# Altium schematic sheet ZYNQ_MIOBank_500.SchDoc
size A4; DocumentNumber: 8; SheetNumber: 8; SheetTotal: 47
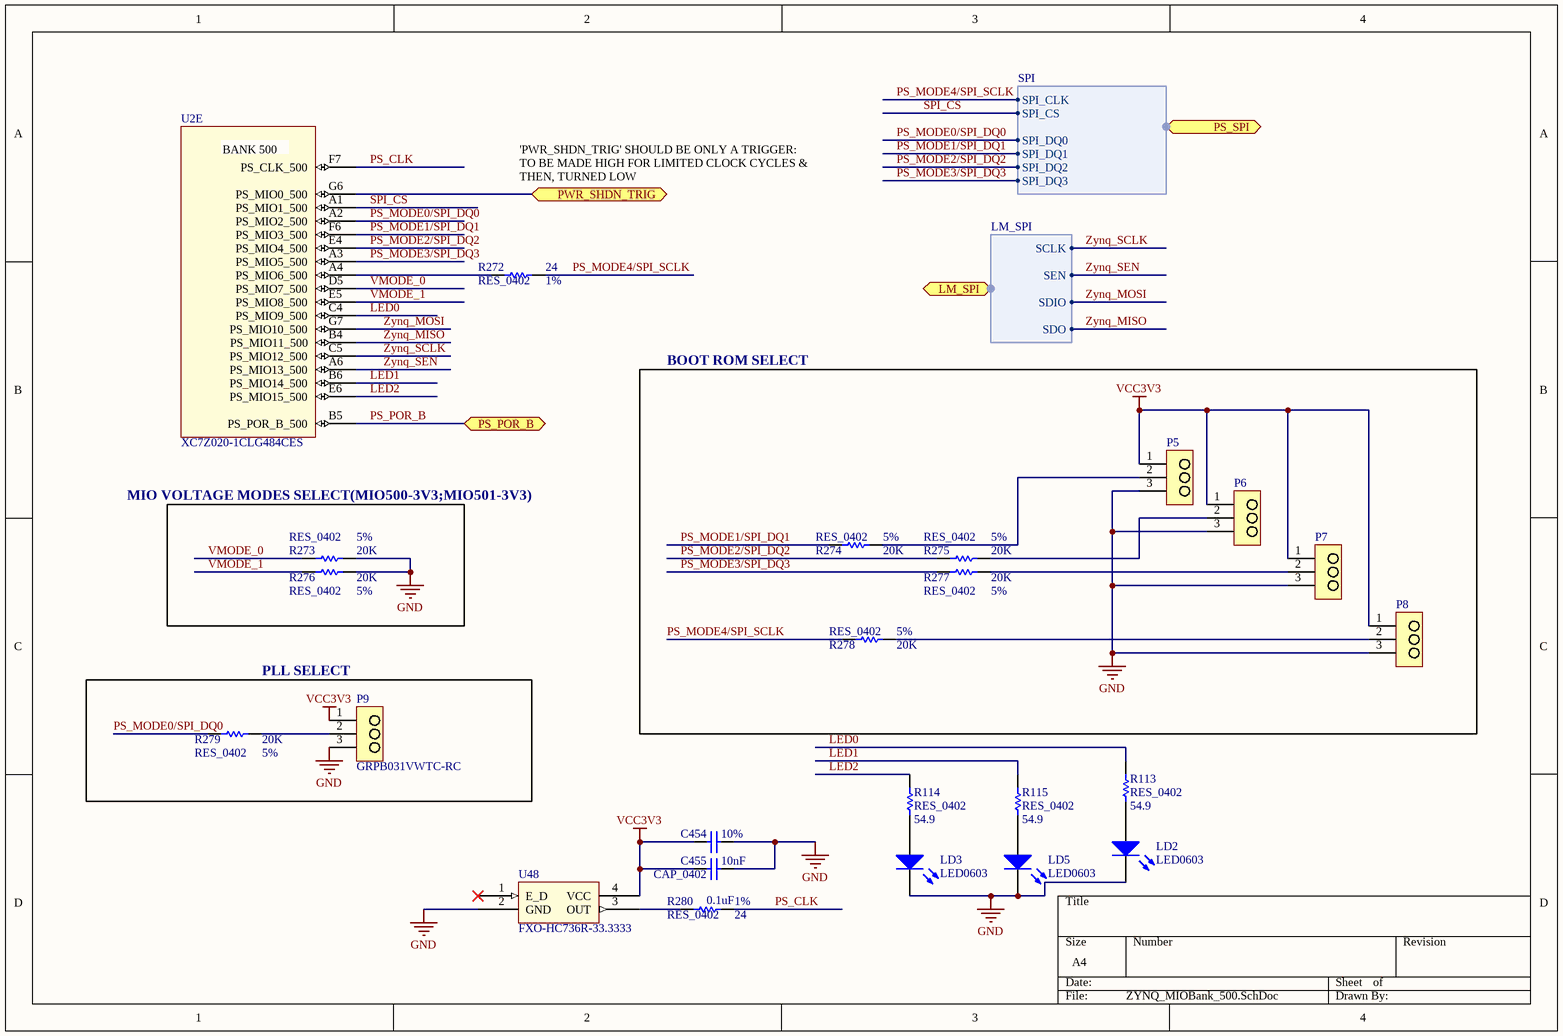
[diagram p0: ZYNQ_MIOBank_500.SchDoc]

## Parts
C454  CAP_0402  value 10nF  Tolerance: 10%  [CAPC0402(1005)60_N]
C455  value 0.1uF  [CAPC0402(1005)60_N]  (hidden comment: TMK105BJ104KV-F)
LD2  LED0603  [LED0603(1608)_HSMG-C190]
LD3  LED0603  [LED0603(1608)_HSMG-C190]
LD5  LED0603  [LED0603(1608)_HSMG-C190]
P5  GRPB031VWTC-RC  [Header_3-Pos_Sullins_GRPB031VWTC-RC]  (value not drawn)
P6  GRPB031VWTC-RC  [Header_3-Pos_Sullins_GRPB031VWTC-RC]  (value not drawn)
P7  GRPB031VWTC-RC  [Header_3-Pos_Sullins_GRPB031VWTC-RC]  (value not drawn)
P8  GRPB031VWTC-RC  [Header_3-Pos_Sullins_GRPB031VWTC-RC]  (value not drawn)
P9  GRPB031VWTC-RC  [Header_3-Pos_Sullins_GRPB031VWTC-RC]
R113  RES_0402  value 54.9  [RESC0402(1005)_N]
R114  RES_0402  value 54.9  [RESC0402(1005)_N]
R115  RES_0402  value 54.9  [RESC0402(1005)_N]
R272  RES_0402  value 24  Tolerance: 1%  [RESC0402(1005)_N]
R273  RES_0402  value 20K  Tolerance: 5%  [RESC0402(1005)_N]
R274  RES_0402  value 20K  Tolerance: 5%  [RESC0402(1005)_N]
R275  RES_0402  value 20K  Tolerance: 5%  [RESC0402(1005)_N]
R276  RES_0402  value 20K  Tolerance: 5%  [RESC0402(1005)_N]
R277  RES_0402  value 20K  Tolerance: 5%  [RESC0402(1005)_N]
R278  RES_0402  value 20K  Tolerance: 5%  [RESC0402(1005)_N]
R279  RES_0402  value 20K  Tolerance: 5%  [RESC0402(1005)_N]
R280  RES_0402  value 24  Tolerance: 1%  [RESC0402(1005)_N]
U2  XC7Z020-1CLG484CES  [ZYNQ_xc7z020clg484pkg_BGA-484]  (part E of 10)
U48  FXO-HC736R-33.3333  [Oscillator_Fox_FXO-HC736R-33.3333_SMD]

## Blocks framed on the sheet
BOOT ROM SELECT: P5-P8 R274 R275 R277 R278
PLL SELECT: P9 R279

## Ports
LM_SPI (harness LM_SPI), PS_POR_B (bidir), PS_SPI (harness SPI), PWR_SHDN_TRIG (bidir)

## Harnesses
SPI: SPI_CLK, SPI_CS, SPI_DQ0, SPI_DQ1, SPI_DQ2, SPI_DQ3
LM_SPI: SCLK, SEN, SDIO, SDO

## Nets
GND: C454.1 C455.1 LD2.1(K) LD3.1(K) LD5.1(K) P5.3 P6.3 P7.3 P8.3 P9.3 R273.2 R276.2 U48.2(GND)
VCC3V3: C454.2 C455.2 P5.1 P6.1 P7.1 P8.1 P9.1 U48.4(VCC)
LED0: R113.2 U2.C4(PS_MIO9_500)
LED1: R115.2 U2.B6(PS_MIO14_500)
LED2: R114.2 U2.E6(PS_MIO15_500)
PS_CLK: R280.2 U2.F7(PS_CLK_500)
PS_MODE0/SPI_DQ0: R279.1 U2.A2(PS_MIO2_500) ; port PS_SPI.SPI_DQ0
PS_MODE1/SPI_DQ1: R274.1 U2.F6(PS_MIO3_500) ; port PS_SPI.SPI_DQ1
PS_MODE2/SPI_DQ2: R275.1 U2.E4(PS_MIO4_500) ; port PS_SPI.SPI_DQ2
PS_MODE3/SPI_DQ3: R277.1 U2.A3(PS_MIO5_500) ; port PS_SPI.SPI_DQ3
PS_MODE4/SPI_SCLK: R272.2 R278.1 ; port PS_SPI.SPI_CLK
PS_POR_B: U2.B5(PS_POR_B_500) ; port PS_POR_B
PWR_SHDN_TRIG: U2.G6(PS_MIO0_500) ; port PWR_SHDN_TRIG
SPI_CS: U2.A1(PS_MIO1_500) ; port PS_SPI.SPI_CS
VMODE_0: R273.1 U2.D5(PS_MIO7_500)
VMODE_1: R276.1 U2.E5(PS_MIO8_500)
Zynq_MISO: U2.B4(PS_MIO11_500) ; port LM_SPI.SDO
Zynq_MOSI: U2.G7(PS_MIO10_500) ; port LM_SPI.SDIO
Zynq_SCLK: U2.C5(PS_MIO12_500) ; port LM_SPI.SCLK
Zynq_SEN: U2.A6(PS_MIO13_500) ; port LM_SPI.SEN
NetLD2_2: LD2.2(A) R113.1
NetLD3_2: LD3.2(A) R114.1
NetLD5_2: LD5.2(A) R115.1
NetP5_2: P5.2 R274.2
NetP6_2: P6.2 R275.2
NetP7_2: P7.2 R277.2
NetP8_2: P8.2 R278.2
NetP9_2: P9.2 R279.2
NetR272_1: R272.1 U2.A4(PS_MIO6_500)
NetR280_1: R280.1 U48.3(OUT)

Not connected (* = marked no-connect by the designer): U48 1(E_D)*

## Notes on the sheet
- 'PWR_SHDN_TRIG' SHOULD BE ONLY A TRIGGER:
  TO BE MADE HIGH FOR LIMITED CLOCK CYCLES & THEN, TURNED LOW
- MIO VOLTAGE MODES SELECT(MIO500-3V3;MIO501-3V3)
- (in symbol XC7Z020-1CLG484CES, part E) BANK 500

## Library data of the parts
C454 = CAP_0402: 10000pF, ceramic, 10% 6.3V X5R, 0402; Part Number: GRM155R60J103KA01D; Manufacturer: Murata Electronics North America; Footprint Ref: CAPC0402(1005)60_N; Library Ref: CAP_0402
C455 = TMK105BJ104KV-F: 0.1uF, ceramic, 10%, 25V, X5R, 0402; Manufacturer: Taiyo Yuden; Tolerance: 10%; Part Number: TMK105BJ104KV-F
LD2 LD3 LD5 = "HSMG-C190": LED 570NM GREEN DIFF 0603 SMD; Manufacturer: Avago; Value: "HSMG-C190 green"; Part Number: "HSMG-C190"; Footprint Ref: LED0603(1608); Library Ref: LED0603
P5-P9 = GRPB031VWTC-RC: CONN HEADER .050" 3POS SMD GOLD; Manufacturer: Sullins Connector Solutions; Part Number: GRPB031VWTC-RC
R113-R115 = ERJ-2RKF54R9X: RES 54.9 OHM 1/10W 1% 0402 SMD; Manufacturer: Panasonic Electronic Components; Tolerance: *; Part Number: ERJ-2RKF54R9X; Footprint Ref: RESC0402(1005)_N; Library Ref: RES_0402
R272 R280 = CRCW040224R0FKED: 24 ohm, 1% 1/16W, 0402; Manufacturer: Vishay/Dale; Part Number: CRCW040224R0FKED
  R272: Footprint Ref: RESC0402(1005)_N; Library Ref: RES_0402
R273-R279 = RES_0402: 20K ohm, 5%, 1/16W, 0402; Part Number: ERJ-2GEJ203X; Manufacturer: Panasonic - ECG; Library Ref: RES_0402; Footprint Ref: RESC0402(1005)_N
U2 = XC7Z020-1CLG484CES: XC7Z020-1CLG484CES, Zynq-7000 All Programmable SoC; Manufacturer: Xilinx; Part Number: XC7Z020-1CLG484CES
U48 = FXO-HC736R-33.3333: OSC 33.3333 MHZ 3.3V HCMOS SMD; Manufacturer: Fox Electronics; Value: 33.333MHz; Part Number: FXO-HC736R-33.3333